# EAGLE design TempControl_V2.0 (EAGLE 8.5.0)
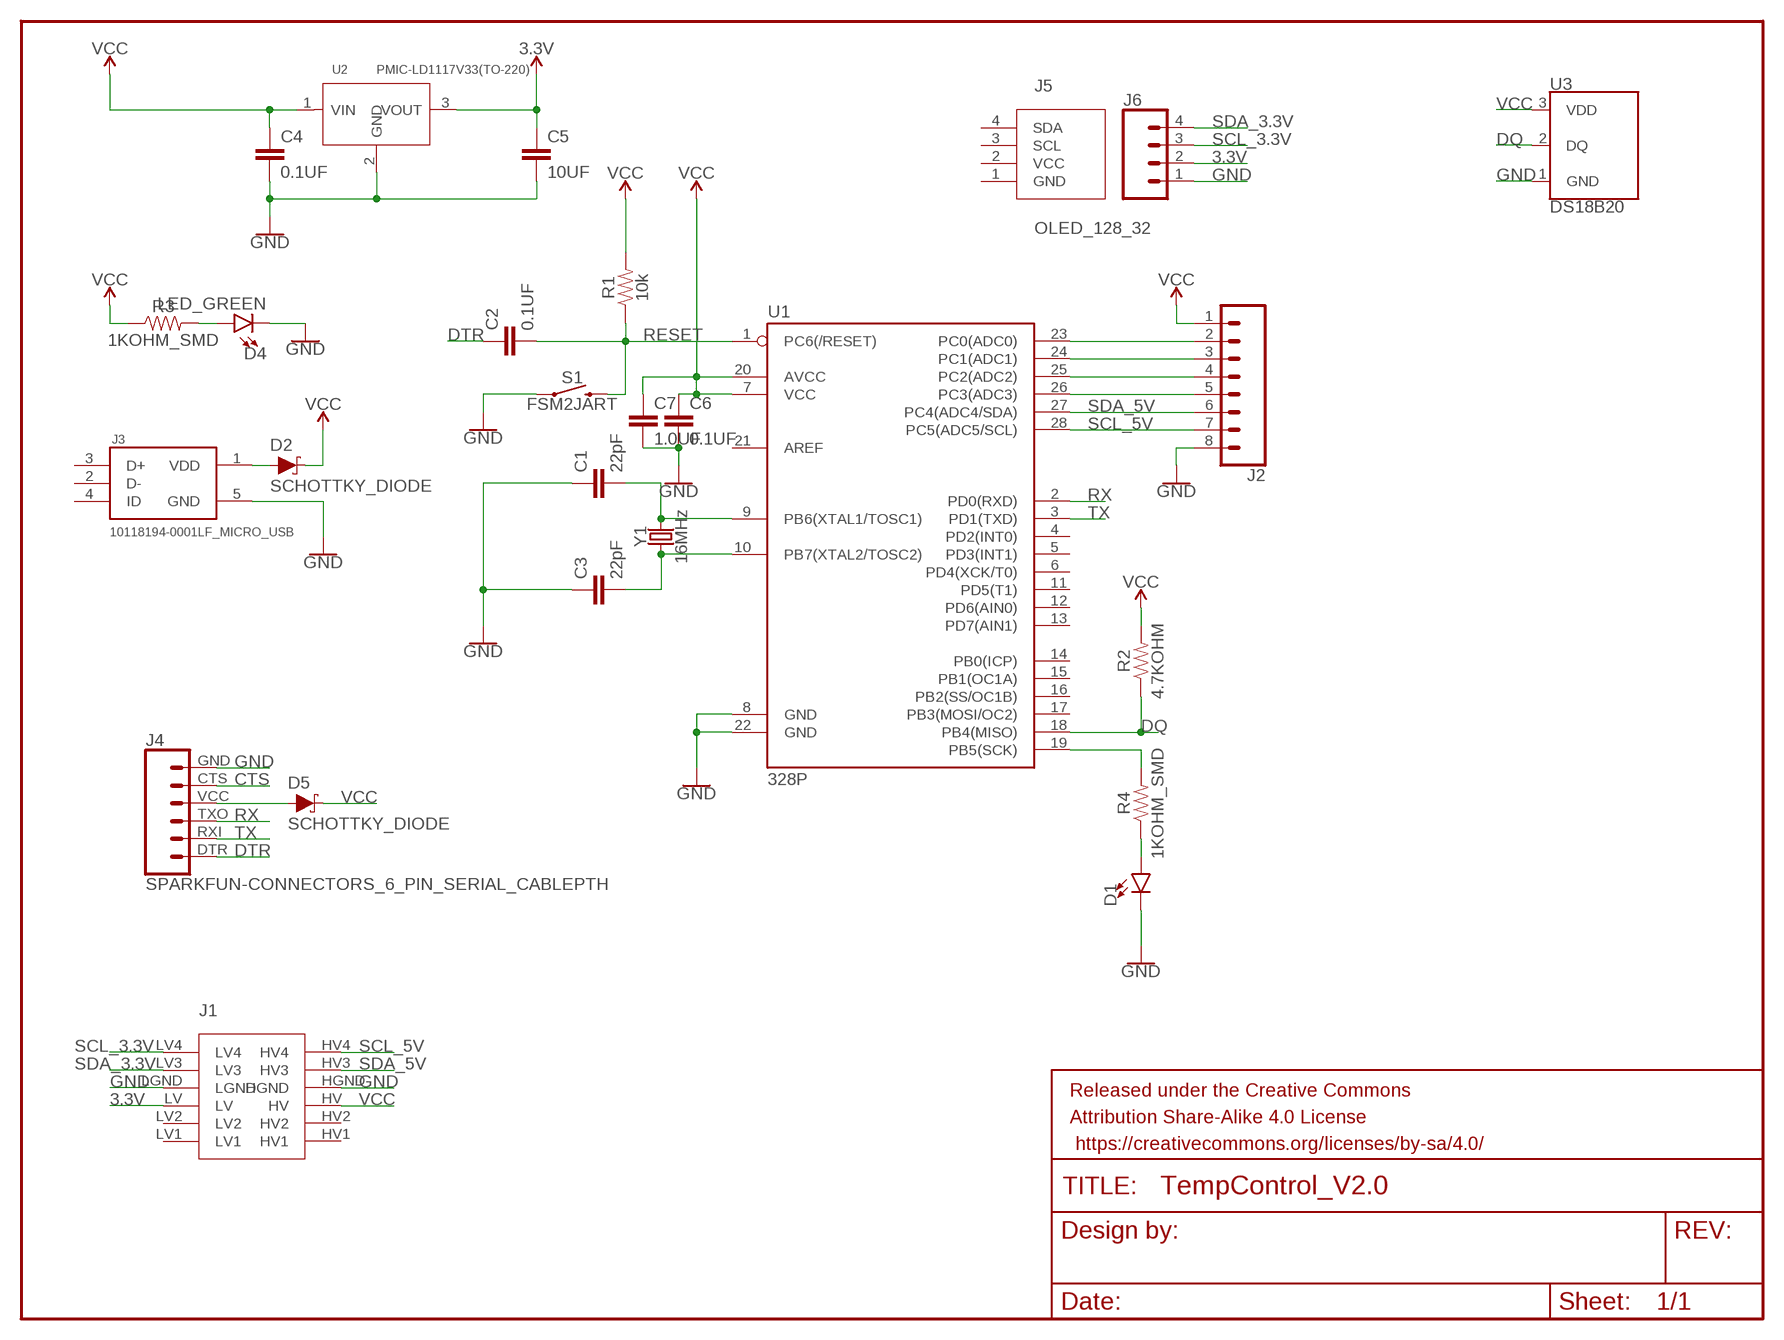
[diagram p0: schematic, sheet 1]

## Parts
C1  22pF  22PF-PTH-2.54MM-200V-5%  [CAP-PTH-2.54]
C2  0.1UF  [CAP-PTH-2.54]
C3  22pF  22PF-PTH-2.54MM-200V-5%  [CAP-PTH-2.54]
C4  0.1UF  [CAP-PTH-2.54]
C5  10UF  [CAP-PTH-5MM]
C6  0.1UF  [CAP-PTH-2.54]
C7  1.0UF  [CAP-PTH-5MM]
D1  LED_RED5MM  [LED_5MM]
D2  SCHOTTKY_DIODE  [DIODE_0805]
D4  LED_GREEN  [LED-0603]
D5  SCHOTTKY_DIODE  [DIODE_0805]
FRAME1  FRAME-LETTERNO_PACKAGE  [DUMMY]
J1  LEVEL_SHIFTER  [LEVEL_SHIFTER]
J2  SPARKFUN-CONNECTORS_CONN_08"  [SPARKFUN-CONNECTORS_1X08]
J3  10118194-0001LF_MICRO_USB  [FRAMATOME_10118194-0001LF]
J4  SPARKFUN-CONNECTORS_6_PIN_SERIAL_CABLEPTH  [SPARKFUN-CONNECTORS_FTDI_BASIC]
J5  OLED_128_32  [OLED_128_32]
J6  CONN_04  [1X04]
R1  10k  10KOHM-HORIZ-1/4W-1%  [AXIAL-0.3]
R2  4.7KOHM  [AXIAL-0.3]
R3  1KOHM_SMD  [0603]
R4  1KOHM_SMD  [0603]
S1  FSM2JART  [FSM2JART]
U1  328P  ATMEGA328P_PDIP  [DIP28]
U2  PMIC-LD1117V33(TO-220)  [TO-220]
U3  DS18B20  [TO-92-AMMO]
Y1  16MHz  CRYSTAL-16MHZPTH-HC49US  [HC49US]

## Nets
3.3V: C5.1 J1.LV J6.2 U2.3(VOUT)
CTS: J4.CTS
DQ: R2.P$1 U1.18(PB4(MISO)) U3.2(DQ)
DTR: C2.1 J4.DTR
GND: C1.1 C3.1 C4.2 C5.2 C6.2 C7.2 D1.K D4.2 J1.HGND J1.LGND J2.8 J3.5(GND) J4.GND J6.1 S1.1 U1.8(GND) U1.22(GND) U2.2(GND) U3.1(GND)
N$1: J2.2 U1.23(PC0(ADC0))
N$2: J2.3 U1.24(PC1(ADC1))
N$3: J2.4 U1.25(PC2(ADC2))
N$4: J2.5 U1.26(PC3(ADC3))
N$7: C1.2 U1.9(PB6(XTAL1/TOSC1)) Y1.2
N$8: R4.2 U1.19(PB5(SCK))
N$9: D2.1 J3.1(VDD)
N$10: D1.A R4.1
N$12: D4.1 R3.2
N$14: C3.2 U1.10(PB7(XTAL2/TOSC2)) Y1.1
N$16: D5.1 J4.VCC
RESET: C2.2 R1.P$1 S1.2 U1.1(PC6(/RESET))
RX: J4.TXO U1.2(PD0(RXD))
SCL_3.3V: J1.LV4 J6.3
SCL_5V: J1.HV4 J2.7 U1.28(PC5(ADC5/SCL))
SDA_3.3V: J1.LV3 J6.4
SDA_5V: J1.HV3 J2.6 U1.27(PC4(ADC4/SDA))
TX: J4.RXI U1.3(PD1(TXD))
VCC: C4.1 C6.1 C7.1 D2.2 D5.2 J1.HV J2.1 R1.P$2 R2.P$2 R3.1 U1.7(VCC) U1.20(AVCC) U2.1(VIN) U3.3(VDD)
Unconnected: J1.HV1 J1.HV2 J1.LV1 J1.LV2 J3.2(D-) J3.3(D+) J3.4(ID) J5.1(GND) J5.2(VCC) J5.3(SCL) J5.4(SDA) U1.4(PD2(INT0)) U1.5(PD3(INT1)) U1.6(PD4(XCK/T0)) U1.11(PD5(T1)) U1.12(PD6(AIN0)) U1.13(PD7(AIN1)) U1.14(PB0(ICP)) U1.15(PB1(OC1A)) U1.16(PB2(SS/OC1B)) U1.17(PB3(MOSI/OC2)) U1.21(AREF)

## Library data of the parts
C1 C3 = TempControl:22PF: 22pF ceramic capacitors A capacitor is a passive two-terminal electrical component used to store electrical energy temporarily in an electric field.; PROD_ID: CAP-09128
C2 C4 C6 = TempControl:0.1UF: 0.1µF ceramic capacitors A capacitor is a passive two-terminal electrical component used to store electrical energy temporarily in an electric field.
C5 = TempControl:10UF
C7 = TempControl:1.0UF
D1 = TempControl:LED_RED: LED (Generic) Standard schematic elements and footprints for 5mm, 3mm, 1206, and 0603 sized LEDs. Generic LEDs with no color specified.
D2 D5 = TempControl:SCHOTTKY_DIODE
D4 = TempControl:LED_GREEN
FRAME1 = TempControl:FRAME-LETTER: Schematic Frame - Letter Standard 8.5x11 US Letter frame; DESIGNER: Nobody; VERSION: v01
J1 = TempControl:LEVEL_SHIFTER
J2 = TempControl:SPARKFUN-CONNECTORS_CONN_08: Multi connection point. Often used as Generic Header-pin footprint for 0.1 inch spaced/style header connections On any of the 0.1 inch spaced packages, you can populate with these: Break Away Headers - Straight <https://www.sparkfun.com/products/116> (PRT-00116) Break Away Male Headers - Right Angle <https://www.sparkfun.com/products/553> (PRT-00553) Female Headers <https://www.sparkfun.com/products/115> (PRT-00115) Break Away Headers - Machine Pin <https://www.sparkfun.com/products/117> (PRT-00117) Break Away Female Headers - Swiss Machine Pin <https://www.sparkfun.com/products/743> (PRT-00743) Arduino Stackable Header - 8 Pin <https://www.sparkfun.com/products/9279> (PRT-09279) For SCREWTERMINALS and SPRING TERMINALS visit here: Screw Terimnals on SparkFun.com <https://www.sparkfun.com/search/results?term=Screw+Terminals> (5mm/3.5mm/2.54mm spacing) This device is also useful as a general connection point to wire up your design to another part of your project. Our various solder wires solder well into these plated through hole pads. Hook-Up Wire - Assortment (Stranded, 22 AWG) <https://www.sparkfun.com/products/11375> (PRT-11375) Hook-Up Wire - Assortment (Solid Core, 22 AWG) <https://www.sparkfun.com/products/11367> (PRT-11367) View the entire wire category on our website here <https://www.sparkfun.com/categories/141> Special notes: Molex polarized connector foot print use with SKU : PRT-08231 with associated crimp pins and housings. 1MM SMD Version SKU: PRT-10208 NOTES ON THE VARIANTS LOCK and LOCK_LONGPADS... This footprint was designed to help hold the alignment of a through-hole component (i.e. 6-pin header) while soldering it into place. You may notice that each hole has been shifted either up or down by 0.005 of an inch from it's more standard position (which is a perfectly straight line). This slight alteration caused the pins (the squares in the middle) to touch the edges of the holes. Because they are alternating, it causes a "brace" to hold the component in place. 0.005 has proven to be the perfect amount of "off-center" position when using our standard breakaway headers. Although looks a little odd when you look at the bare footprint, once you have a header in there, the alteration is very hard to notice. Also,if you push a header all the way into place, it is covered up entirely on the bottom side.; PROD_ID: CONN-08438
J3 = TempControl:10118194-0001LF_MICRO_USB: Conn Micro USB Type B RCP 5 POS 0.65mm Solder RA SMD 5 Terminal 1 Port T/R; AVAILABILITY: Good; DESCRIPTION: Conn Micro USB Type B RCP 5 POS 0.65mm Solder RA SMD 5 Terminal 1 Port T/R; MF: Amphenol; MP: 10118194-0001LF; PACKAGE: DIP-4 FCI; PRICE: 0.24 USD
J4 = TempControl:SPARKFUN-CONNECTORS_6_PIN_SERIAL_CABLE: 6-pin header connection for use with the "FTDI BASIC" pinout - CABLE SIDE. Also known as "Arduino Serial Program Header". This is used on a design to provide a 6-pin connection point for serial communication usually from a USB cable (D+/D-) to these headers (RX/TX). It also has the remaining pins necessary for programming in the Arduino evironment (DTR, GND, and sometimes VCC). Note, this device has "CABLE" in the name. It is intended to be used on a design that usually lives on the end of your USB cable and prvides the converter chip (FTDI232 or FTDI231x) to commnicate serial RX/TX. The "sister" device, named "TARGET" is inteneded to be used on a design that contains a target micro-controller that you wish to program. You can populate with some of these: Female Headers <https://www.sparkfun.com/products/115> (PRT-00115) For reference (or to suit your programming needs) check out these designs: SparkFun FTDI Basic Breakout - 5V <https://www.sparkfun.com/products/9716> (DEV-09716) SparkFun FTDI Basic Breakout - 3.3V <https://www.sparkfun.com/products/9873> (DEV-09873) SparkFun FTDI SmartBasic <https://www.sparkfun.com/products/12935> (DEV-12935) SparkFun Beefy 3 - FTDI Basic Breakout <https://www.sparkfun.com/products/13746> (DEV-13746)
J5 = TempControl:OLED_128_32
J6 = TempControl:CONN_04: Multi connection point. Often used as Generic Header-pin footprint for 0.1 inch spaced/style header connections On any of the 0.1 inch spaced packages, you can populate with these: Break Away Headers - Straight <https://www.sparkfun.com/products/116> (PRT-00116) Break Away Male Headers - Right Angle <https://www.sparkfun.com/products/553> (PRT-00553) Female Headers <https://www.sparkfun.com/products/115> (PRT-00115) Break Away Headers - Machine Pin <https://www.sparkfun.com/products/117> (PRT-00117) Break Away Female Headers - Swiss Machine Pin <https://www.sparkfun.com/products/743> (PRT-00743) For SCREWTERMINALS and SPRING TERMINALS visit here: Screw Terimnals on SparkFun.com <https://www.sparkfun.com/search/results?term=Screw+Terminals> (5mm/3.5mm/2.54mm spacing) This device is also useful as a general connection point to wire up your design to another part of your project. Our various solder wires solder well into these plated through hole pads. Hook-Up Wire - Assortment (Stranded, 22 AWG) <https://www.sparkfun.com/products/11375> (PRT-11375) Hook-Up Wire - Assortment (Solid Core, 22 AWG) <https://www.sparkfun.com/products/11367> (PRT-11367) View the entire wire category on our website here <https://www.sparkfun.com/categories/141> Special notes: Molex polarized connector foot print use with SKU : PRT-08231 with associated crimp pins and housings. 1MM SMD Version SKU: PRT-10208; PROD_ID: CONN-09696
R1 = TempControl:10KOHM: 10kΩ resistor A resistor is a passive two-terminal electrical component that implements electrical resistance as a circuit element. Resistors act to reduce current flow, and, at the same time, act to lower voltage levels within circuits. - Wikipedia; PROD_ID: RES-12183
R2 = TempControl:4.7KOHM
R3 R4 = TempControl:1KOHM_SMD
S1 = TempControl:FSM2JART
U1 = TempControl:ATMEGA328P_PDIP: Atmel 328P Through hole ATMEGA328P uC used in the Arduino 32kb flash, 1k EEPROM, 2k SRAM Datasheet <http://www.sparkfun.com/datasheets/Components/SMD/ATMega328.pdf> SparkFun Products Storefront component: AVR 28 Pin 20MHz 32K 6A/D - ATMega328P <https://www.sparkfun.com/products/9061> (COM-09061) SparkFun Simon Says - Through-Hole Soldering Kit <https://www.sparkfun.com/products/10547> (KIT-10547) SparkFun Learn to Solder - Simon Says <https://www.sparkfun.com/products/13708> (KIT-13708) SparkFun BigTime Watch Kit <https://www.sparkfun.com/products/11734> (KIT-11734) SparkFun ClockIt <https://www.sparkfun.com/products/10930> (KIT-10930) SparkFun Serial Enabled LCD Kit <https://www.sparkfun.com/products/10097> (LCD-10097) SparkFun Simon Tilts - Through Hole Soldering Kit <https://www.sparkfun.com/products/12634> (KIT-12634) SparkFun Frequency Counter Kit <https://www.sparkfun.com/products/10140> (KIT-10140) FabFM Radio Kit <https://www.sparkfun.com/products/11043> (KIT-11043) SparkFun Binary Blaster Kit <https://www.sparkfun.com/products/12037> (KIT-12037) SparkFun Metro-Gnome <https://www.sparkfun.com/products/9236> (KIT-09236) ATmega328 with Arduino Optiboot (Uno) <https://www.sparkfun.com/products/10524> (DEV-10524); PROD_ID: IC-09136
U2 = TempControl:PMIC-LD1117V33(TO-220): 310030025; AVAILABILITY: Good; DESCRIPTION: IC REG LINEAR 3.3V 800MA TO220AB; MF: STMicroelectronics; MP: LD1117V33; PACKAGE: TO-220 STMicroelectronics; PRICE: 0.31 USD
U3 = TempControl:DS18B20: Dallas/Maxim DS18B20 1-Wire Temperature Sensor The DS18B20 reports degrees C with 9 to 12-bit precision, -55C to 125C (+/-0.5C). Each sensor has a unique 64-Bit Serial number etched into it - allows for a huge number of sensors to be used on one data bus. Datasheet <http://datasheets.maximintegrated.com/en/ds/DS18B20.pdf> SparkFun Products One Wire Digital Temperature Sensor - DS18B20 <https://www.sparkfun.com/products/245> (SEN-00245); STORE_ID: SEN-00245
Y1 = TempControl:CRYSTAL-16MHZ: 16MHz Crystal Digikey Example <http://www.digikey.com/product-search/en?keywords=535-9122-1-ND> Frequency: 16MHz Frequency Stability: ±50ppm Frequency Tolerance: ±20ppm Load Capacitance: 18pF SparkFun Products: Pro Micro -5V/16MHz <https://www.sparkfun.com/products/12640> SparkFun Serial Enabled LCD Kit <https://www.sparkfun.com/products/10097>; PROD_ID: XTAL-08181; SF_ID: COM-00536

## Board
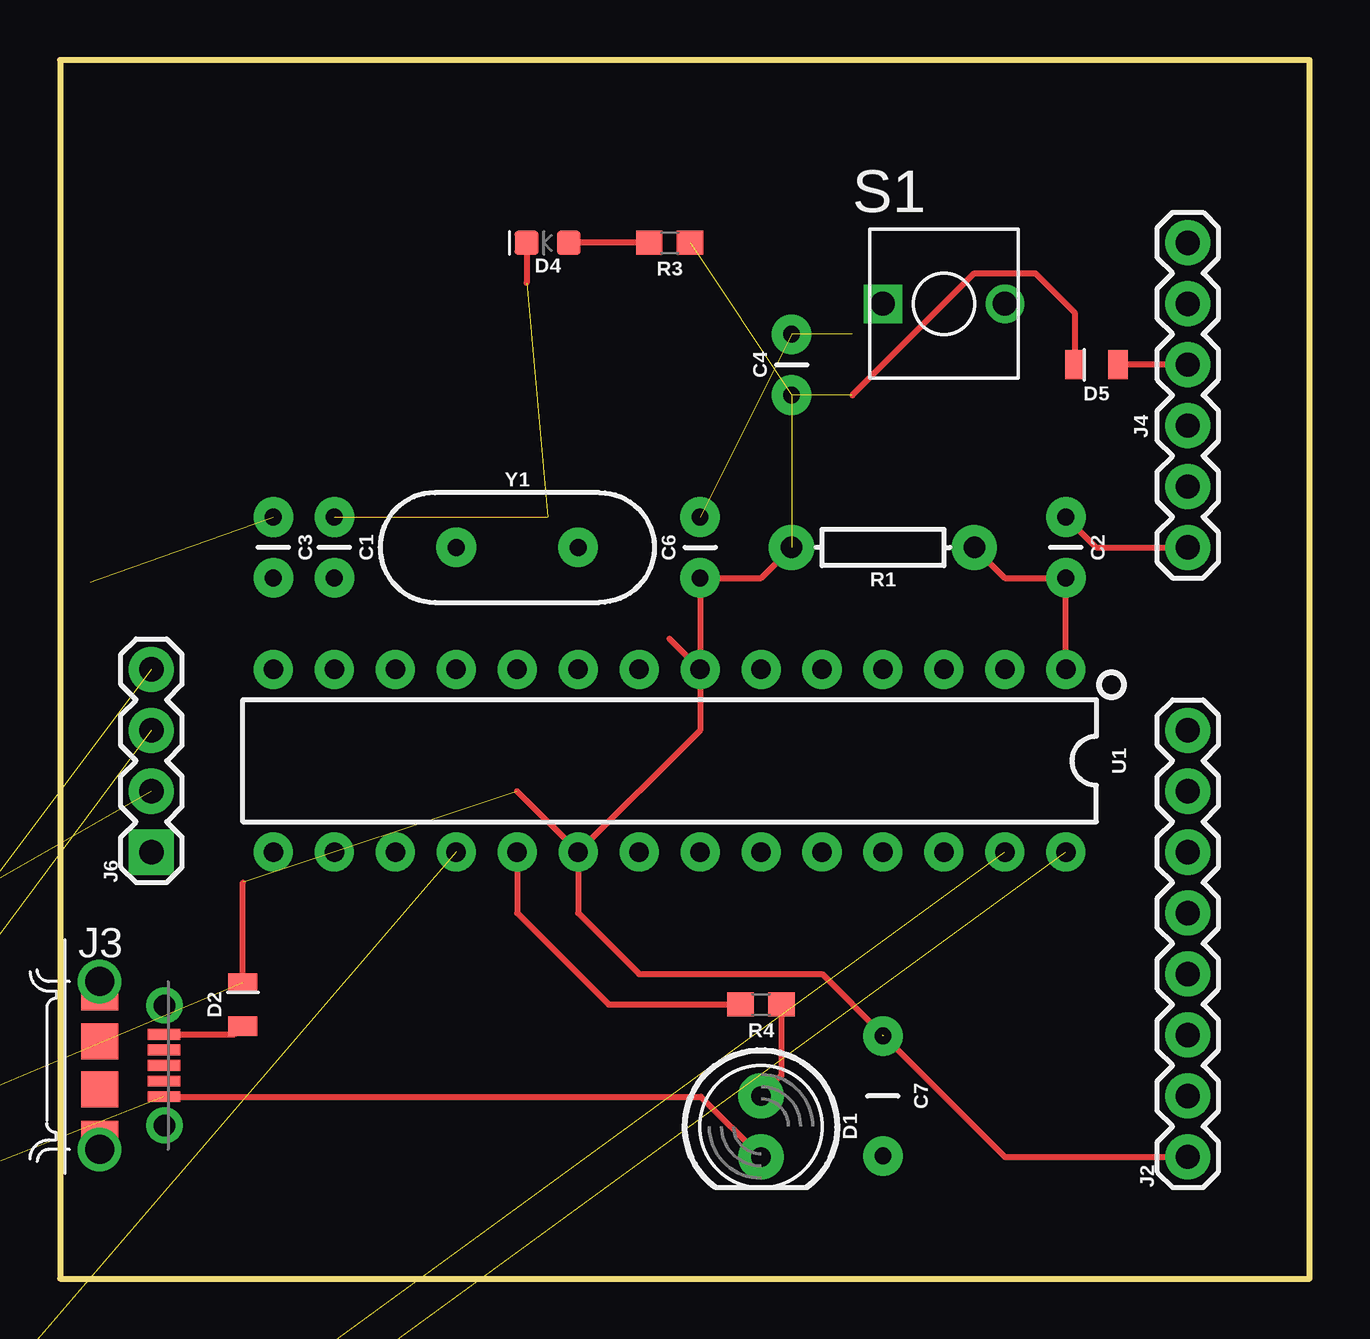
[diagram p1: board, top side]
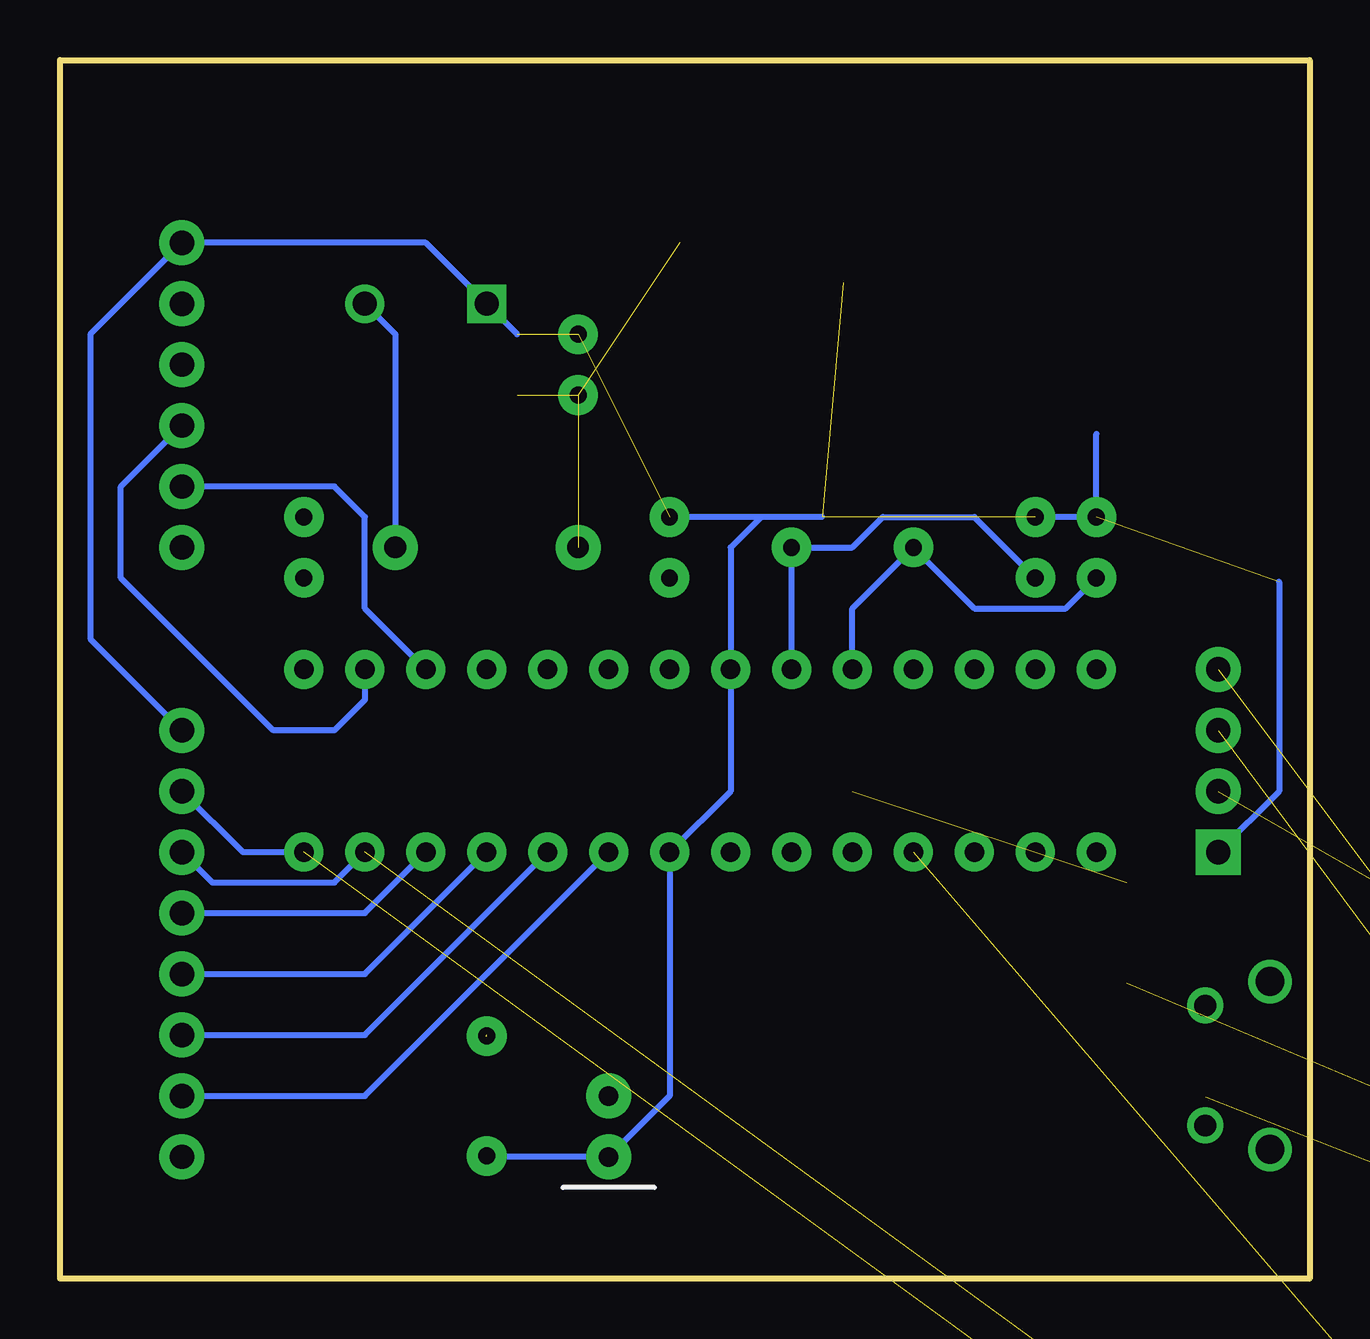
[diagram p2: board, bottom side, seen from below]

Size 52.07 x 50.8 mm. Coordinates in mm from the lower left corner, seen from the top.
Outline: 0,50.8 0,0 52.07,0 52.07,50.8 0,50.8
Copper layers (1*16): Top 0.035mm / dielectric 1.5mm / Bottom 0.035mm
Design rules "SparkFun": minimum track width 8mil, minimum drill 20mil, track to track 8mil, track to pad 8mil, pad to pad 8mil, via to via 8mil, smd to smd 8mil, copper to edge 8mil, drill to drill 8mil, minimum pad ring 12mil, minimum via ring 10mil, stop-mask expansion 4mil, vias tented up to drill 20mil, thermal gap 10mil

### Footprints (pad centres in the part's own frame; a part is rotated, then mirrored left to right if it is on the bottom)
CAP-PTH-2.54 = drill 0.7 pad 1.651: 1 -1.27,0; 2 1.27,0
CAP-PTH-5MM = drill 0.7 pad 1.651: 1 -2.5,0; 2 2.5,0
LED_5MM = drill 0.813 pad 1.88: A -1.27,0; K 1.27,0
DIODE_0805 = smd 0.8 x 1.2: 1 -0.9,0; 2 0.9,0
LED-0603 = smd 1 x 1: 1 -0.877,0; 2 0.877,0
LEVEL_SHIFTER = drill 1.016 pad 1.88: HGND 7.62,10.16; HV 5.08,10.16; HV1 0,10.16; HV2 2.54,10.16; HV3 10.16,10.16; HV4 12.7,10.16; LGND 7.62,0; LV 5.08,0; LV2 2.54,0; LV3 10.16,0; LV4 12.7,0 | drill 1.016 pad 1.88 square: LV1 0,0
SPARKFUN-CONNECTORS_1X08 = drill 1.016 pad 1.88: 1 0,0; 2 2.54,0; 3 5.08,0; 4 7.62,0; 5 10.16,0; 6 12.7,0; 7 15.24,0; 8 17.78,0
FRAMATOME_10118194-0001LF = smd 0.45 x 1.35: 1 -1.3,2.675; 2 -0.65,2.675; 3 0,2.675; 4 0.65,2.675; 5 1.3,2.675 | drill 0.9: P$6 -2.5,2.7; P$7 2.5,2.7 | drill 1.2: P$8 -3.5,0; P$9 3.5,0 | smd 1.5 x 1.55: P$10 -1,0; P$11 1,0; P$12 -3.05,0; P$13 3.05,0
SPARKFUN-CONNECTORS_FTDI_BASIC = drill 1.016 pad 1.88: CTS 10.16,0; DTR 0,0; GND 12.7,0; RXI 2.54,0; TXO 5.08,0; VCC 7.62,0
OLED_128_32 = drill 1.016 square: 1 0,0 | drill 1.016: 2 0,2.54; 3 0,5.08; 4 0,7.62
1X04 = drill 1.016 pad 1.88 square: 1 0,0 | drill 1.016 pad 1.88: 2 2.54,0; 3 5.08,0; 4 7.62,0
AXIAL-0.3 = drill 0.9 pad 1.88: P$1 -3.81,0; P$2 3.81,0
0603 = smd 1.1 x 1: 1 -0.85,0; 2 0.85,0
FSM2JART = drill 1 square: 1 -2.54,0 | drill 1: 2 2.54,0
DIP28 = drill 0.813 pad 1.626: 1 -16.51,-3.81; 2 -13.97,-3.81; 3 -11.43,-3.81; 4 -8.89,-3.81; 5 -6.35,-3.81; 6 -3.81,-3.81; 7 -1.27,-3.81; 8 1.27,-3.81; 9 3.81,-3.81; 10 6.35,-3.81; 11 8.89,-3.81; 12 11.43,-3.81; 13 13.97,-3.81; 14 16.51,-3.81; 15 16.51,3.81; 16 13.97,3.81; 17 11.43,3.81; 18 8.89,3.81; 19 6.35,3.81; 20 3.81,3.81; 21 1.27,3.81; 22 -1.27,3.81; 23 -3.81,3.81; 24 -6.35,3.81; 25 -8.89,3.81; 26 -11.43,3.81; 27 -13.97,3.81; 28 -16.51,3.81
TO-220 = drill 1.27 pad 2.032 long: 1 -2.54,-11.43; 2 0,-11.43; 3 2.54,-11.43
TO-92-AMMO = drill 0.813 pad 1.88: 1 -2.54,0; 2 0,0; 3 2.54,0
HC49US = drill 0.7 pad 1.651: 1 -2.54,0; 2 2.54,0

### Placement (x,y rotation side)
C1  11.43,30.48 270 top
C2  41.91,30.48 270 top
C3  8.89,30.48 270 top
C4  30.48,38.1 90 top
C5  -77.47,-43.18 0 top  (outside the outline)
C6  26.67,30.48 90 top
C7  34.29,7.62 270 top
D1  29.21,6.35 270 top
D2  7.62,11.43 90 top
D4  20.32,43.18 180 top
D5  43.18,38.1 180 top
FRAME1  -40.64,17.78 0 top  (outside the outline)
J1  -78.74,-71.12 0 top  (outside the outline)
J2  46.99,5.08 90 top
J3  1.65,8.89 270 top
J4  46.99,30.48 90 top
J5  -50.8,-26.67 0 top  (outside the outline)
J6  3.81,17.78 90 top
R1  34.29,30.48 180 top
R2  -74.93,-109.22 0 top  (outside the outline)
R3  25.4,43.18 180 top
R4  29.21,11.43 180 top
S1  36.83,40.64 0 top
U1  25.4,21.59 180 top
U2  -76.2,-12.7 0 top  (outside the outline)
U3  -76.2,-90.17 0 top  (outside the outline)
Y1  19.05,30.48 0 top

### Tracks (layer width: path | path; a pad name or v marks a point on that pad's centre or on a via)
3.3V  (3 unrouted)
DQ  (2 unrouted)
DTR
  Top 0.254: C2.1 43.18,30.48 J4.DTR
GND  (10 unrouted)
  Top 0.254: D4.2 19.44,41.52 | J3.5 26.7,7.59 D1.K
  Bottom 0.254: 8.89,35.21 C3.1 C1.1 | 20.32,31.75 22.86,31.75 | 22.86,31.75 24.13,30.48 U1.8 24.13,20.32 U1.22 26.67,7.62 D1.K 34.25,5.08 C7.2 | 22.86,31.75 C6.2 | 33.02,39.37 S1.1 36.83,43.18 J4.GND 50.8,39.37 50.8,26.67 J2.8 | 1.27,29.05 1.27,20.32 J6.1
N$1
  Bottom 0.254: J2.2 39.37,7.62 U1.23
N$2
  Bottom 0.254: J2.3 39.37,10.16 U1.24
N$3
  Bottom 0.254: J2.4 39.37,12.7 U1.25
N$4
  Bottom 0.254: J2.5 39.37,15.24 U1.26
N$7
  Bottom 0.254: U1.9 Y1.2 19.05,30.48 17.78,31.75 13.97,31.75 C1.2
N$8
  Top 0.254: U1.19 19.05,15.24 22.86,11.43 R4.2
N$9
  Top 0.254: J3.1 7.28,10.19 D2.1
N$10
  Top 0.254: R4.1 30.06,8.47 D1.A
N$12
  Top 0.254: R3.2 D4.1
N$14
  Bottom 0.254: U1.10 19.05,27.94 Y1.1 13.97,27.94 10.16,27.94 C3.2
N$16
  Top 0.254: J4.VCC D5.1
RESET
  Top 0.254: U1.1 C2.2 39.37,29.21 R1.P$1
  Bottom 0.254: S1.2 38.1,39.37 R1.P$1
RX
  Bottom 0.254: U1.2 39.37,24.13 40.64,22.86 43.18,22.86 49.53,29.21 49.53,33.02 J4.TXO
SCL_3.3V  (1 unrouted)
SCL_5V  (1 unrouted)
  Bottom 0.254: J2.7 44.45,17.78 U1.28
SDA_3.3V  (1 unrouted)
SDA_5V  (1 unrouted)
  Bottom 0.254: J2.6 45.72,16.51 40.64,16.51 U1.27
TX
  Bottom 0.254: U1.3 39.37,27.94 39.37,31.75 40.64,33.02 J4.RXI
VCC  (10 unrouted)
  Top 0.254: 25.4,26.67 U1.7 | U1.7 C6.1 29.21,29.21 R1.P$2 | 33.02,36.83 38.1,41.91 40.64,41.91 42.28,40.27 D5.2 | U1.20 21.59,15.24 24.13,12.7 31.75,12.7 34.29,10.16 | 34.33,10.12 39.37,5.08 J2.1 | D2.2 7.62,16.51 | 19.05,20.32 U1.20 | U1.7 26.67,22.86 U1.20